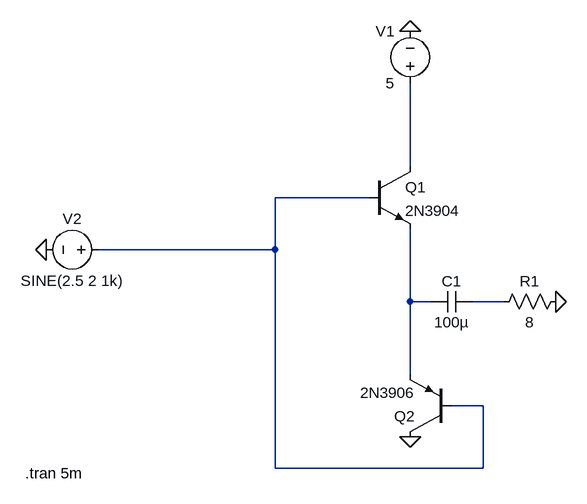
[diagram p0: schematic Project2PushPullB.asc]
Project2PushPullB.asc, the LTspice schematic file:
Version 4.1
SHEET 1 880 680
WIRE 272 32 272 -96
WIRE 208 80 64 80
WIRE 64 160 64 80
WIRE 64 160 -208 160
WIRE 272 240 272 128
WIRE 304 240 272 240
WIRE 416 240 368 240
WIRE 272 352 272 240
WIRE 384 400 336 400
WIRE 64 496 64 160
WIRE 384 496 384 400
WIRE 384 496 64 496
FLAG -288 160 0
FLAG 496 240 0
FLAG 272 448 0
FLAG 272 -176 0
SYMBOL npn 208 32 R0
SYMATTR InstName Q1
SYMATTR Value 2N3904
SYMBOL voltage -192 160 R90
WINDOW 0 -32 56 VBottom 2
WINDOW 3 32 56 VTop 2
WINDOW 123 0 0 Left 0
WINDOW 39 0 0 Left 0
SYMATTR InstName V2
SYMATTR Value SINE(2.5 2 1k)
SYMBOL res 512 224 R90
WINDOW 0 0 56 VBottom 2
WINDOW 3 32 56 VTop 2
SYMATTR InstName R1
SYMATTR Value 8
SYMBOL pnp 336 448 R180
SYMATTR InstName Q2
SYMATTR Value 2N3906
SYMBOL voltage 272 -80 R180
WINDOW 0 24 96 Left 2
WINDOW 3 24 16 Left 2
WINDOW 123 0 0 Left 0
WINDOW 39 0 0 Left 0
SYMATTR InstName V1
SYMATTR Value 5
SYMBOL cap 304 256 R270
WINDOW 0 32 32 VTop 2
WINDOW 3 0 32 VBottom 2
SYMATTR InstName C1
SYMATTR Value 100µ
TEXT -320 504 Left 2 !.tran 5m

The netlist it stands for:
* Project2PushPullB.asc
Q1 N001 N002 N003 0 2N3904
V2 N002 0 SINE(2.5 2 1k)
R1 0 N004 8
Q2 0 N002 N003 0 2N3906
V1 N001 0 5
C1 N003 N004 100µ
.model NPN NPN
.model PNP PNP
.lib standard.bjt
.tran 5m
.backanno
.end